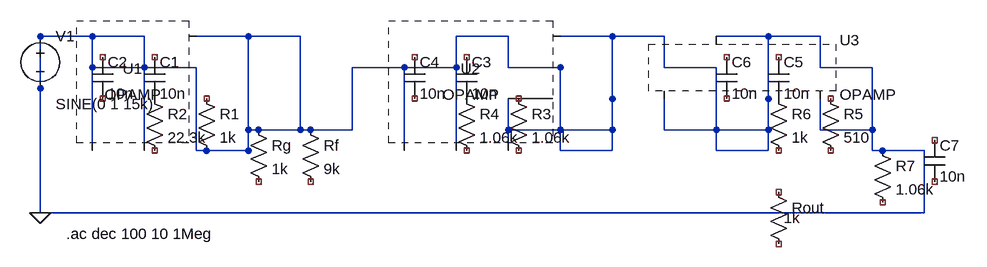
[diagram p0: schematic Draft1.asc]
Draft1.asc, the LTspice schematic file:
Version 4
SHEET 1 880 680
WIRE 80 96 0 96
WIRE 160 96 80 96
WIRE 80 144 80 96
WIRE 160 144 160 96
WIRE 160 144 80 144
WIRE 240 144 160 144
WIRE 160 192 160 144
WIRE 240 192 240 144
WIRE 160 240 160 192
WIRE 240 240 240 192
WIRE 80 272 80 144
WIRE 160 272 160 240
WIRE 240 272 240 240
WIRE 320 272 240 272
WIRE 320 272 320 96
WIRE 320 96 240 96
WIRE 400 96 320 96
WIRE 400 144 400 96
WIRE 400 192 400 144
WIRE 320 240 320 272
WIRE 400 240 400 192
WIRE 400 240 320 240
WIRE 480 240 400 240
WIRE 480 144 480 240
WIRE 560 144 480 144
WIRE 640 144 560 144
WIRE 640 96 640 144
WIRE 720 96 640 96
WIRE 720 144 720 96
WIRE 800 144 720 144
WIRE 800 240 800 144
WIRE 720 240 800 240
WIRE 720 192 720 240
WIRE 640 192 640 144
WIRE 640 240 640 192
WIRE 560 240 560 144
WIRE 560 272 560 240
WIRE 640 272 640 240
WIRE 720 272 720 240
WIRE 800 272 800 240
WIRE 800 272 880 272
WIRE 880 272 880 96
WIRE 880 96 800 96
WIRE 960 96 880 96
WIRE 960 144 960 96
WIRE 1040 144 960 144
WIRE 1040 240 1040 144
WIRE 960 240 1040 240
WIRE 960 192 960 240
WIRE 880 192 880 96
WIRE 880 240 880 192
WIRE 800 240 800 144
WIRE 800 240 880 240
WIRE 1040 272 1040 240
WIRE 1040 272 1120 272
WIRE 1120 272 1120 96
WIRE 1120 96 1040 96
WIRE 1200 96 1120 96
WIRE 1200 144 1200 96
WIRE 1280 144 1200 144
WIRE 1280 240 1280 144
WIRE 1200 240 1280 240
WIRE 1200 192 1200 240
WIRE 1120 192 1120 96
WIRE 1120 240 1120 192
WIRE 1040 240 1120 240
WIRE 1280 272 1280 240
WIRE 1280 272 1360 272
WIRE 0 368 0 96
WIRE 1360 368 1360 272
WIRE 1360 368 0 368
FLAG 0 368 0
SYMBOL voltage 0 80 R0
WINDOW 3 24 120 Left 2
SYMATTR Value SINE(0 1 15k)
SYMATTR SpiceLine Rser=1
SYMATTR InstName V1
SYMBOL opamp2 80 208 R0
SYMATTR InstName U1
SYMATTR Value OPAMP
SYMBOL res 240 176 R0
SYMATTR InstName R1
SYMATTR Value 1k
SYMBOL res 160 176 R0
SYMATTR InstName R2
SYMATTR Value 22.3k
SYMBOL cap 160 128 R0
SYMATTR InstName C1
SYMATTR Value 10n
SYMBOL cap 80 128 R0
SYMATTR InstName C2
SYMATTR Value 10n
SYMBOL res 400 224 R0
SYMATTR InstName Rf
SYMATTR Value 9k
SYMBOL res 320 224 R0
SYMATTR InstName Rg
SYMATTR Value 1k
SYMBOL opamp2 560 208 R0
SYMATTR InstName U2
SYMATTR Value OPAMP
SYMBOL res 720 176 R0
SYMATTR InstName R3
SYMATTR Value 1.06k
SYMBOL res 640 176 R0
SYMATTR InstName R4
SYMATTR Value 1.06k
SYMBOL cap 640 128 R0
SYMATTR InstName C3
SYMATTR Value 10n
SYMBOL cap 560 128 R0
SYMATTR InstName C4
SYMATTR Value 10n
SYMBOL opamp2 1040 208 R0
SYMATTR InstName U3
SYMATTR Value OPAMP
SYMBOL res 1200 176 R0
SYMATTR InstName R5
SYMATTR Value 510
SYMBOL res 1120 176 R0
SYMATTR InstName R6
SYMATTR Value 1k
SYMBOL cap 1120 128 R0
SYMATTR InstName C5
SYMATTR Value 10n
SYMBOL cap 1040 128 R0
SYMATTR InstName C6
SYMATTR Value 10n
SYMBOL res 1280 256 R0
SYMATTR InstName R7
SYMATTR Value 1.06k
SYMBOL cap 1360 256 R0
SYMATTR InstName C7
SYMATTR Value 10n
SYMBOL res 1120 320 R0
WINDOW 3 24 56 Left 2
SYMATTR InstName Rout
SYMATTR Value 1k
TEXT 40 400 Left 2 !.ac dec 100 10 1Meg

The netlist it stands for:
* Draft1.asc
V1 0 0 SINE(0 1 15k) Rser=1
* U1: OPAMP (symbol opamp2 not available, pin order unknown); nets seen at it: 0
R1 NC_01 0 1k
R2 P001 NC_02 22.3k
C1 NC_03 P001 10n
C2 NC_04 NC_05 10n
Rf 0 NC_06 9k
Rg 0 NC_07 1k
* U2: OPAMP (symbol opamp2 not available, pin order unknown); nets seen at it: 0
R3 NC_08 NC_09 1.06k
R4 P002 NC_10 1.06k
C3 NC_11 P002 10n
C4 NC_12 NC_13 10n
* U3: OPAMP (symbol opamp2 not available, pin order unknown); nets seen at it: 0
R5 NC_14 NC_15 510
R6 P003 NC_16 1k
C5 NC_17 P003 10n
C6 NC_18 NC_19 10n
R7 0 NC_20 1.06k
C7 NC_21 NC_22 10n
Rout NC_23 NC_24 1k
.ac dec 100 10 1Meg
.backanno
.end